# Altium schematic sheet 信号输出调理电路.SchDoc
size A4
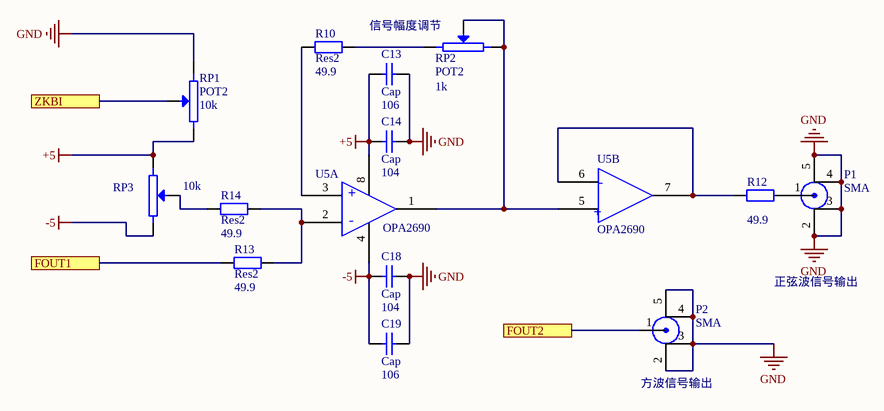
[diagram p0: 信号输出调理电路.SchDoc]

## Parts
C13  Cap  value 106  [C0805]
C14  Cap  value 104  [C0805]
C18  Cap  value 104  [C0805]
C19  Cap  value 106  [C0805]
P1  SMA  [SMA-KE]
P2  SMA  [SMA-KE]
R10  Res2  value 49.9  [6-0805_N]
R12  value 49.9  [6-0805_N]  (hidden comment: Res2)
R13  Res2  value 49.9  [6-0805_N]
R14  Res2  value 49.9  [6-0805_N]
RP1  POT2  value 10k  [VR7]
RP2  POT2  value 1k  [VR7]
RP3  value 10k  [VR7]  (hidden comment: POT2)
U5  OPA2690  [SO-8]  (parts A,B of 2)

## Ports
FOUT1, FOUT2, ZKBI

## Nets
+5: C13.2 C14.2 RP1.1 RP3.1 U5.8
-5: C18.2 C19.2 RP3.2 U5.4
GND: C13.1 C14.1 C18.1 C19.1 P1.2 P1.3 P1.4 P1.5 P2.2 P2.3 P2.4 P2.5 RP1.2
FOUT1: R13.1 ; port FOUT1
FOUT2: P2.1 ; port FOUT2
ZKBI: RP1.3 ; port ZKBI
NetP1_1: P1.1 R12.2
NetR10_1: R10.1 U5.3
NetR10_2: R10.2 RP2.1
NetR12_1: R12.1 U5.6 U5.7
NetR13_2: R13.2 R14.2 U5.2
NetR14_1: R14.1 RP3.3
NetRP2_2: RP2.2 RP2.3 U5.1 U5.5

## Notes on the sheet
- 信号幅度调节
- 正弦波信号输出
- (near P2) 方波信号输出
- (in symbol OPA2690, part A) +; -
- (in symbol OPA2690, part B) -; +

## Library data of the parts
C13 C14 C18 C19 = Cap: Capacitor; Published: 8-Jun-2000; LatestRevisionDate: 17-Jul-2002; LatestRevisionNote: Re-released for DXP Platform.; PackageReference: RAD-0.3; Publisher: Altium Limited; PackageDescription: Radial Cap, Thru-Hole; 2 Leads; 0.3 in Pin Spacing
R10 R12-R14 = Res2: Resistor; Published: 8-Jun-2000; LatestRevisionDate: 17-Jul-2002; LatestRevisionNote: Re-released for DXP Platform.; PackageReference: AXIAL-0.4; Publisher: Altium Limited; PackageDescription: Axial Device, Thru-Hole; 2 Leads; 0.4 in Pin Spacing
RP1-RP3 = POT2: Potentiometer